# Altium schematic sheet VOU_SOM_CV_V0.0.1.SchDoc
size 593 x 419 mm; DocumentNumber: 1; SheetNumber: 1; SheetTotal: 12; Razrabotal: Савицкий
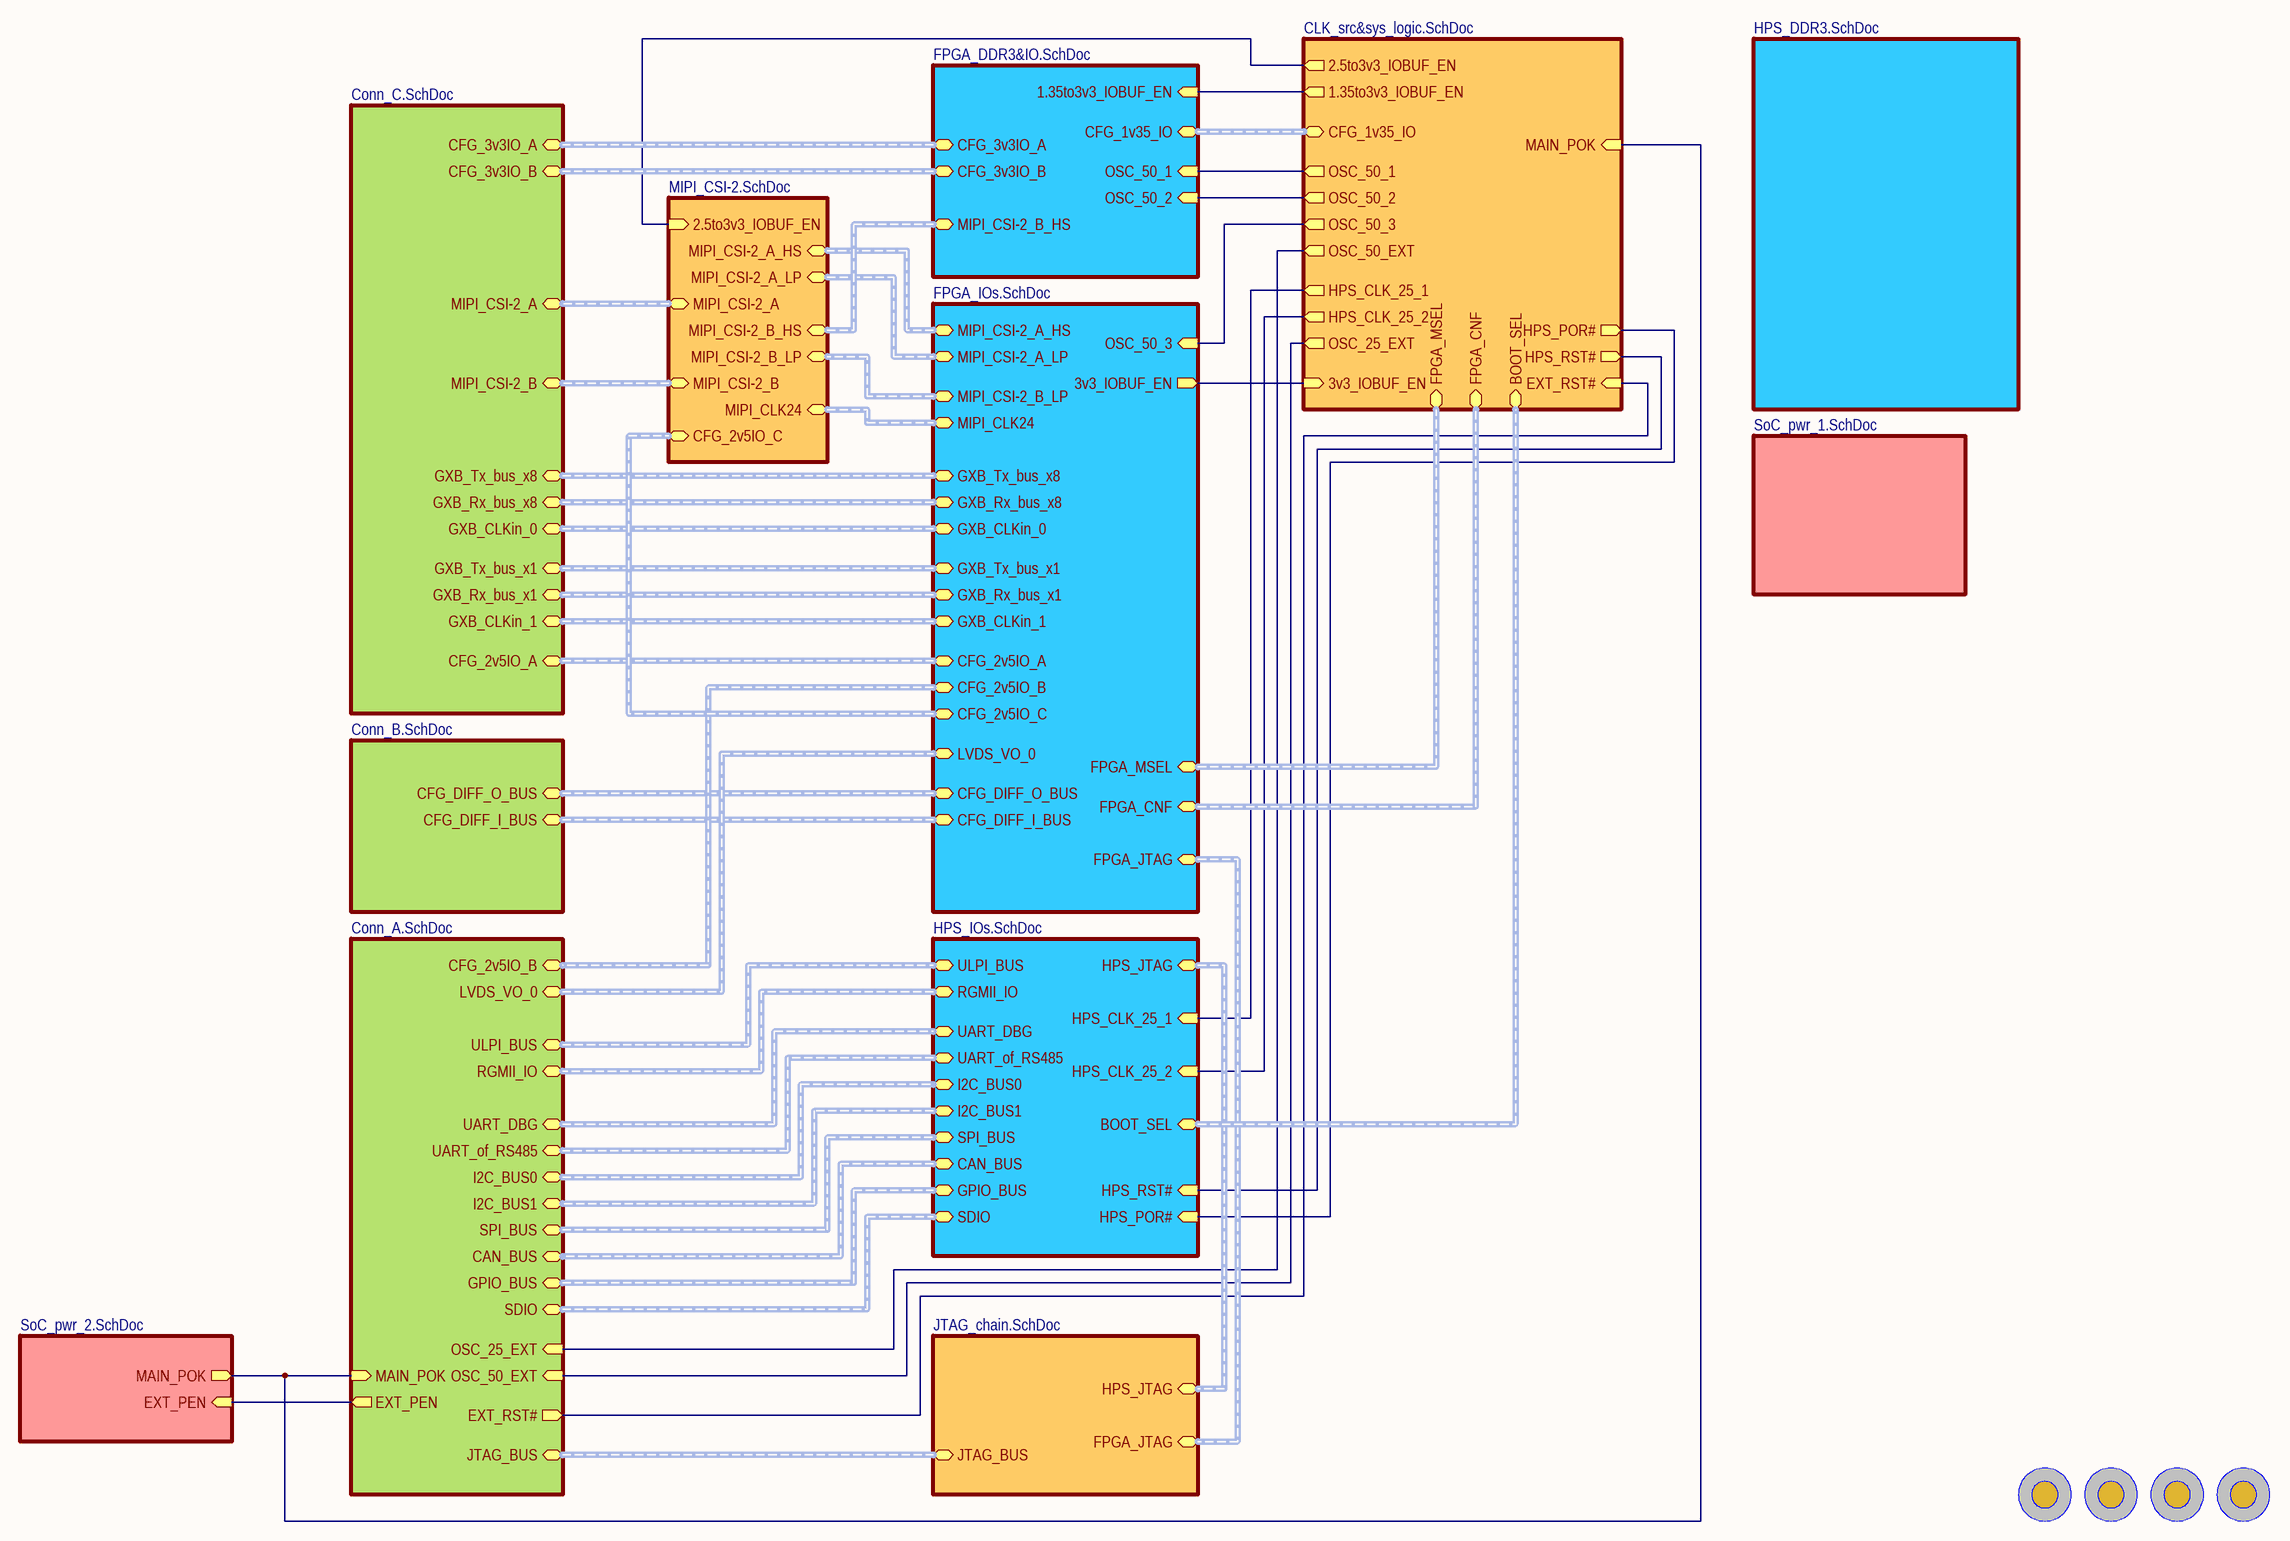
[diagram p0: VOU_SOM_CV_V0.0.1.SchDoc]

## Parts
RP_BL  Comment  [Reper-Normal]  (value not drawn)  (no BOM)
RP_BR  Comment  [Reper-Normal]  (value not drawn)  (no BOM)
RP_LT  Comment  [Reper-Normal]  (value not drawn)  (no BOM)
RP_RT  Comment  [Reper-Normal]  (value not drawn)  (no BOM)

## Sub-sheets
CLK_src&sys_logic.SchDoc = CLK_src&sys_logic.SchDoc: HPS_CLK_25_1 (out), HPS_CLK_25_2 (out), OSC_50_1 (out), OSC_50_2 (out), OSC_50_3 (out), OSC_50_EXT (out), OSC_25_EXT (out), MAIN_POK (in), EXT_RST# (in), 3v3_IOBUF_EN (in), 1.35to3v3_IOBUF_EN (out), 2.5to3v3_IOBUF_EN (out), HPS_RST# (out), HPS_POR# (out), FPGA_MSEL (harness FPGA_MSEL), FPGA_CNF (harness FPGA_CNF), BOOT_SEL (harness BOOT_SEL), CFG_1v35_IO (harness CFG_1v35_IO)
Conn_A.SchDoc = Conn_A.SchDoc: MAIN_POK (in), EXT_PEN (out), ULPI_BUS (harness ULPI_BUS), RGMII_IO (harness RGMII_IO), UART_DBG (harness UART_DBG), UART_of_RS485 (harness UART_of_RS485), I2C_BUS0 (harness I2C_BUS0), I2C_BUS1 (harness I2C_BUS1), SPI_BUS (harness SPI_BUS), CFG_2v5IO_B (harness CFG_2v5IO_B), JTAG_BUS (harness JTAG_BUS), LVDS_VO_0 (harness LVDS_VO_0), CAN_BUS (harness CAN_BUS), GPIO_BUS (harness GPIO_BUS), SDIO (harness SDIO), OSC_50_EXT (in), OSC_25_EXT (in), EXT_RST# (out)
Conn_B.SchDoc = Conn_B.SchDoc: CFG_DIFF_I_BUS (harness CFG_DIFF_I_BUS), CFG_DIFF_O_BUS (harness CFG_DIFF_O_BUS)
Conn_C.SchDoc = Conn_C.SchDoc: CFG_2v5IO_A (harness CFG_2v5IO_A), CFG_3v3IO_A (harness CFG_3v3IO_A), CFG_3v3IO_B (harness CFG_3v3IO_B), MIPI_CSI-2_A (harness MIPI_CSI-2_A), MIPI_CSI-2_B (harness MIPI_CSI-2_B), GXB_Tx_bus_x8 (harness GXB_Tx_bus_x8), GXB_Rx_bus_x1 (harness GXB_Rx_bus_x1), GXB_Rx_bus_x8 (harness GXB_Rx_bus_x8), GXB_Tx_bus_x1 (harness GXB_Tx_bus_x1), GXB_CLKin_0 (harness GXB_CLKin_0), GXB_CLKin_1 (harness GXB_CLKin_1)
DIMS_DSP_MainBoard_Interface.SchDoc = MIPI_CSI-2.SchDoc: MIPI_CSI-2_B_HS (harness MIPI_CSI-2_B_HS), MIPI_CSI-2_B_LP (harness MIPI_CSI-2_B_LP), MIPI_CSI-2_A_HS (harness MIPI_CSI-2_A_HS), MIPI_CSI-2_A_LP (harness MIPI_CSI-2_A_LP), MIPI_CSI-2_A (harness MIPI_CSI-2_A), MIPI_CSI-2_B (harness MIPI_CSI-2_B), MIPI_CLK24 (harness MIPI_CLK24), 2.5to3v3_IOBUF_EN (in), CFG_2v5IO_C (harness CFG_2v5IO_C)
FPGA_DDR3&IO.SchDoc = FPGA_DDR3&IO.SchDoc: MIPI_CSI-2_B_HS (harness MIPI_CSI-2_B_HS), CFG_3v3IO_A (harness CFG_3v3IO_A), CFG_3v3IO_B (harness CFG_3v3IO_B), OSC_50_1 (in), OSC_50_2 (in), 1.35to3v3_IOBUF_EN (in), CFG_1v35_IO (harness CFG_1v35_IO)
FPGA_IOs.SchDoc = FPGA_IOs.SchDoc: MIPI_CSI-2_B_LP (harness MIPI_CSI-2_B_LP), MIPI_CSI-2_A_LP (harness MIPI_CSI-2_A_LP), MIPI_CSI-2_A_HS (harness MIPI_CSI-2_A_HS), CFG_2v5IO_A (harness CFG_2v5IO_A), CFG_2v5IO_B (harness CFG_2v5IO_B), GXB_Rx_bus_x1 (harness GXB_Rx_bus_x1), GXB_Tx_bus_x1 (harness GXB_Tx_bus_x1), GXB_CLKin_1 (harness GXB_CLKin_1), GXB_Tx_bus_x8 (harness GXB_Tx_bus_x8), GXB_Rx_bus_x8 (harness GXB_Rx_bus_x8), GXB_CLKin_0 (harness GXB_CLKin_0), CFG_DIFF_I_BUS (harness CFG_DIFF_I_BUS), CFG_DIFF_O_BUS (harness CFG_DIFF_O_BUS), FPGA_JTAG (harness FPGA_JTAG), LVDS_VO_0 (harness LVDS_VO_0), FPGA_MSEL (harness FPGA_MSEL), OSC_50_3 (in), MIPI_CLK24 (harness MIPI_CLK24), 3v3_IOBUF_EN (out), FPGA_CNF (harness FPGA_CNF), CFG_2v5IO_C (harness CFG_2v5IO_C)
HPS_DDR3.SchDoc = HPS_DDR3.SchDoc: no entries
HPS_IOs.SchDoc = HPS_IOs.SchDoc: ULPI_BUS (harness ULPI_BUS), RGMII_IO (harness RGMII_IO), UART_DBG (harness UART_DBG), UART_of_RS485 (harness UART_of_RS485), I2C_BUS0 (harness I2C_BUS0), I2C_BUS1 (harness I2C_BUS1), SPI_BUS (harness SPI_BUS), CAN_BUS (harness CAN_BUS), GPIO_BUS (harness GPIO_BUS), HPS_JTAG (harness HPS_JTAG), SDIO (harness SDIO), HPS_CLK_25_1 (in), HPS_CLK_25_2 (in), HPS_RST# (in), HPS_POR# (in), BOOT_SEL (harness BOOT_SEL)
JTAG_chain.SchDoc = JTAG_chain.SchDoc: JTAG_BUS (harness JTAG_BUS), HPS_JTAG (harness HPS_JTAG), FPGA_JTAG (harness FPGA_JTAG)
SoC_pwr_1.SchDoc = SoC_pwr_1.SchDoc: no entries
SoC_pwr_2.SchDoc = SoC_pwr_2.SchDoc: MAIN_POK (out), EXT_PEN (in)

## Nets
(unnamed): sheet FPGA_DDR3&IO.SchDoc/OSC_50_1, sheet CLK_src&sys_logic.SchDoc/OSC_50_1
(unnamed): sheet FPGA_DDR3&IO.SchDoc/OSC_50_2, sheet CLK_src&sys_logic.SchDoc/OSC_50_2
(unnamed): sheet FPGA_DDR3&IO.SchDoc/1.35to3v3_IOBUF_EN, sheet CLK_src&sys_logic.SchDoc/1.35to3v3_IOBUF_EN
(unnamed): sheet Conn_A.SchDoc/MAIN_POK, sheet CLK_src&sys_logic.SchDoc/MAIN_POK, sheet SoC_pwr_2.SchDoc/MAIN_POK
(unnamed): sheet Conn_A.SchDoc/EXT_PEN, sheet SoC_pwr_2.SchDoc/EXT_PEN
(unnamed): sheet Conn_A.SchDoc/OSC_50_EXT, sheet CLK_src&sys_logic.SchDoc/OSC_25_EXT
(unnamed): sheet Conn_A.SchDoc/OSC_25_EXT, sheet CLK_src&sys_logic.SchDoc/OSC_50_EXT
(unnamed): sheet Conn_A.SchDoc/EXT_RST#, sheet CLK_src&sys_logic.SchDoc/EXT_RST#
(unnamed): sheet FPGA_IOs.SchDoc/OSC_50_3, sheet CLK_src&sys_logic.SchDoc/OSC_50_3
(unnamed): sheet FPGA_IOs.SchDoc/3v3_IOBUF_EN, sheet CLK_src&sys_logic.SchDoc/3v3_IOBUF_EN
(unnamed): sheet HPS_IOs.SchDoc/HPS_CLK_25_1, sheet CLK_src&sys_logic.SchDoc/HPS_CLK_25_1
(unnamed): sheet HPS_IOs.SchDoc/HPS_CLK_25_2, sheet CLK_src&sys_logic.SchDoc/HPS_CLK_25_2
(unnamed): sheet HPS_IOs.SchDoc/HPS_RST#, sheet CLK_src&sys_logic.SchDoc/HPS_RST#
(unnamed): sheet HPS_IOs.SchDoc/HPS_POR#, sheet CLK_src&sys_logic.SchDoc/HPS_POR#
(unnamed): sheet DIMS_DSP_MainBoard_Interface.SchDoc/2.5to3v3_IOBUF_EN, sheet CLK_src&sys_logic.SchDoc/2.5to3v3_IOBUF_EN

## Buses and harness runs
harness sheet CLK_src&sys_logic.SchDoc/BOOT_SEL = sheet HPS_IOs.SchDoc/BOOT_SEL
harness sheet CLK_src&sys_logic.SchDoc/CFG_1v35_IO = sheet FPGA_DDR3&IO.SchDoc/CFG_1v35_IO
harness sheet CLK_src&sys_logic.SchDoc/FPGA_CNF = sheet FPGA_IOs.SchDoc/FPGA_CNF
harness sheet CLK_src&sys_logic.SchDoc/FPGA_MSEL = sheet FPGA_IOs.SchDoc/FPGA_MSEL
harness sheet Conn_A.SchDoc/CAN_BUS = sheet HPS_IOs.SchDoc/CAN_BUS
harness sheet Conn_A.SchDoc/CFG_2v5IO_B = sheet FPGA_IOs.SchDoc/CFG_2v5IO_B
harness sheet Conn_A.SchDoc/GPIO_BUS = sheet HPS_IOs.SchDoc/GPIO_BUS
harness sheet Conn_A.SchDoc/I2C_BUS0 = sheet HPS_IOs.SchDoc/I2C_BUS0
harness sheet Conn_A.SchDoc/I2C_BUS1 = sheet HPS_IOs.SchDoc/I2C_BUS1
harness sheet Conn_A.SchDoc/JTAG_BUS = sheet JTAG_chain.SchDoc/JTAG_BUS
harness sheet Conn_A.SchDoc/LVDS_VO_0 = sheet FPGA_IOs.SchDoc/LVDS_VO_0
harness sheet Conn_A.SchDoc/RGMII_IO = sheet HPS_IOs.SchDoc/RGMII_IO
harness sheet Conn_A.SchDoc/SDIO = sheet HPS_IOs.SchDoc/SDIO
harness sheet Conn_A.SchDoc/SPI_BUS = sheet HPS_IOs.SchDoc/SPI_BUS
harness sheet Conn_A.SchDoc/UART_DBG = sheet HPS_IOs.SchDoc/UART_DBG
harness sheet Conn_A.SchDoc/UART_of_RS485 = sheet HPS_IOs.SchDoc/UART_of_RS485
harness sheet Conn_A.SchDoc/ULPI_BUS = sheet HPS_IOs.SchDoc/ULPI_BUS
harness sheet Conn_B.SchDoc/CFG_DIFF_I_BUS = sheet FPGA_IOs.SchDoc/CFG_DIFF_I_BUS
harness sheet Conn_B.SchDoc/CFG_DIFF_O_BUS = sheet FPGA_IOs.SchDoc/CFG_DIFF_O_BUS
harness sheet Conn_C.SchDoc/CFG_2v5IO_A = sheet FPGA_IOs.SchDoc/CFG_2v5IO_A
harness sheet Conn_C.SchDoc/CFG_3v3IO_A = sheet FPGA_DDR3&IO.SchDoc/CFG_3v3IO_A
harness sheet Conn_C.SchDoc/CFG_3v3IO_B = sheet FPGA_DDR3&IO.SchDoc/CFG_3v3IO_B
harness sheet Conn_C.SchDoc/GXB_CLKin_0 = sheet FPGA_IOs.SchDoc/GXB_CLKin_0
harness sheet Conn_C.SchDoc/GXB_CLKin_1 = sheet FPGA_IOs.SchDoc/GXB_CLKin_1
harness sheet Conn_C.SchDoc/GXB_Rx_bus_x1 = sheet FPGA_IOs.SchDoc/GXB_Rx_bus_x1
harness sheet Conn_C.SchDoc/GXB_Rx_bus_x8 = sheet FPGA_IOs.SchDoc/GXB_Rx_bus_x8
harness sheet Conn_C.SchDoc/GXB_Tx_bus_x1 = sheet FPGA_IOs.SchDoc/GXB_Tx_bus_x1
harness sheet Conn_C.SchDoc/GXB_Tx_bus_x8 = sheet FPGA_IOs.SchDoc/GXB_Tx_bus_x8
harness sheet Conn_C.SchDoc/MIPI_CSI-2_A = sheet DIMS_DSP_MainBoard_Interface.SchDoc/MIPI_CSI-2_A
harness sheet Conn_C.SchDoc/MIPI_CSI-2_B = sheet DIMS_DSP_MainBoard_Interface.SchDoc/MIPI_CSI-2_B
harness sheet DIMS_DSP_MainBoard_Interface.SchDoc/CFG_2v5IO_C = sheet FPGA_IOs.SchDoc/CFG_2v5IO_C
harness sheet DIMS_DSP_MainBoard_Interface.SchDoc/MIPI_CLK24 = sheet FPGA_IOs.SchDoc/MIPI_CLK24
harness sheet DIMS_DSP_MainBoard_Interface.SchDoc/MIPI_CSI-2_A_HS = sheet FPGA_IOs.SchDoc/MIPI_CSI-2_A_HS
harness sheet DIMS_DSP_MainBoard_Interface.SchDoc/MIPI_CSI-2_A_LP = sheet FPGA_IOs.SchDoc/MIPI_CSI-2_A_LP
harness sheet DIMS_DSP_MainBoard_Interface.SchDoc/MIPI_CSI-2_B_HS = sheet FPGA_DDR3&IO.SchDoc/MIPI_CSI-2_B_HS
harness sheet DIMS_DSP_MainBoard_Interface.SchDoc/MIPI_CSI-2_B_LP = sheet FPGA_IOs.SchDoc/MIPI_CSI-2_B_LP
harness sheet FPGA_IOs.SchDoc/FPGA_JTAG = sheet JTAG_chain.SchDoc/FPGA_JTAG
harness sheet HPS_IOs.SchDoc/HPS_JTAG = sheet JTAG_chain.SchDoc/HPS_JTAG

## Notes on the sheet
- Перв. примен.
- Справ. №
- Подп. и дата
- Инв. № дубл.
- Взам. инв. №
- Изм.
- Лист
- № докум.
- Подп.
- Дата
- Лит.
- Масса
- Масштаб
- Разраб.
- Пров.
- Т.контр.
- Схема электрическая принципиальная
- Листов
- Инв. № подл.
- Н.контр.
- Утв.
- Копировал:
- Формат А2

## Library data of the parts
RP_BL RP_BR RP_LT RP_RT = Reper: Стабилизатор положительного напряжения